# EAGLE board NeuroStimDuino (EAGLE 9.6.2)
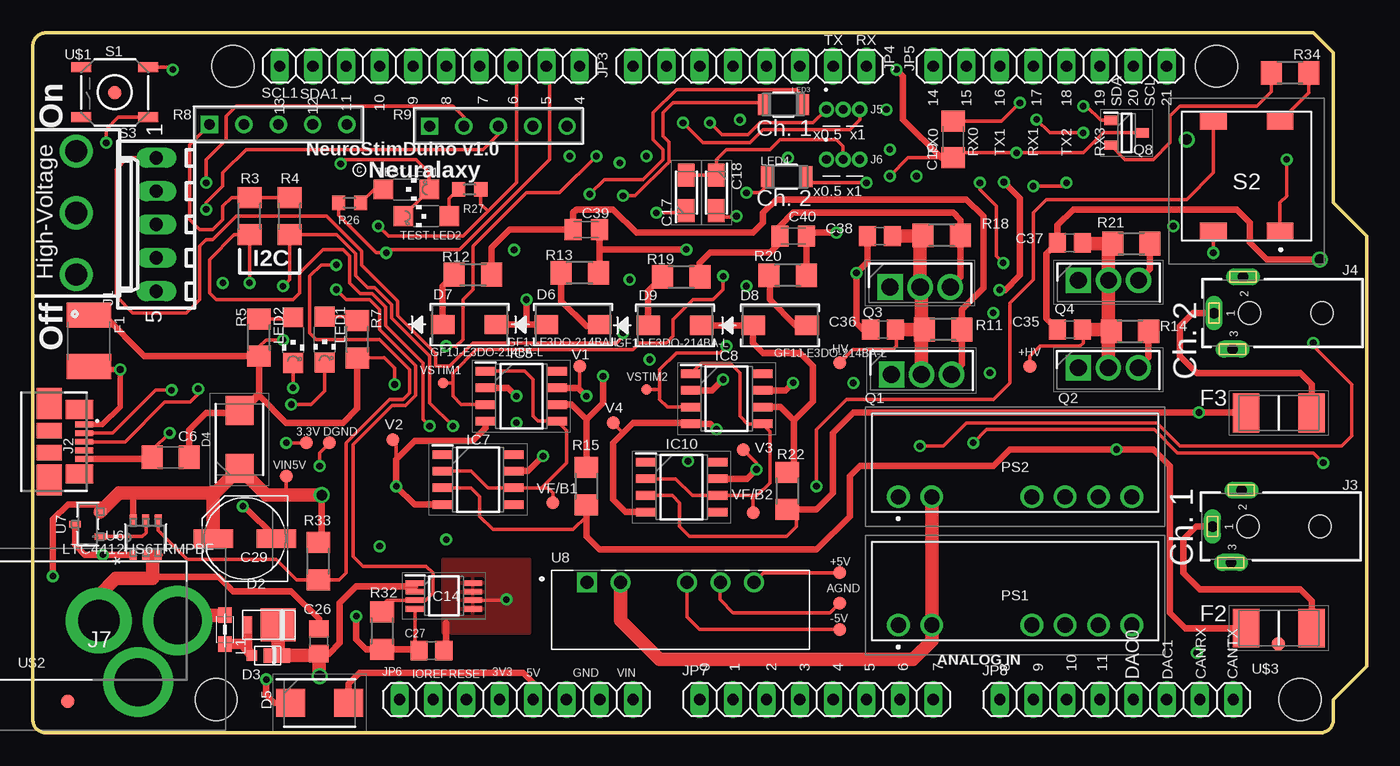
[diagram p6: board, top side]
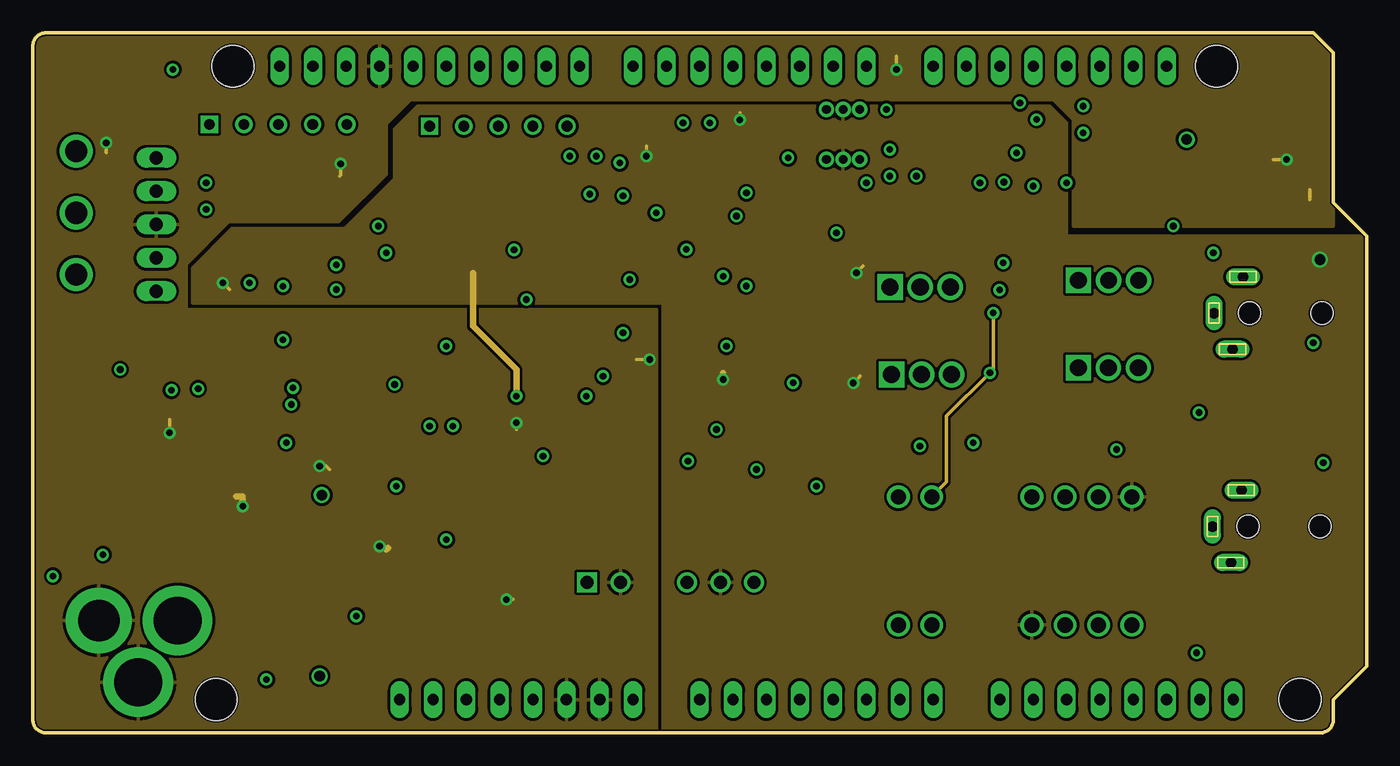
[diagram p7: board, inner layer Route2]
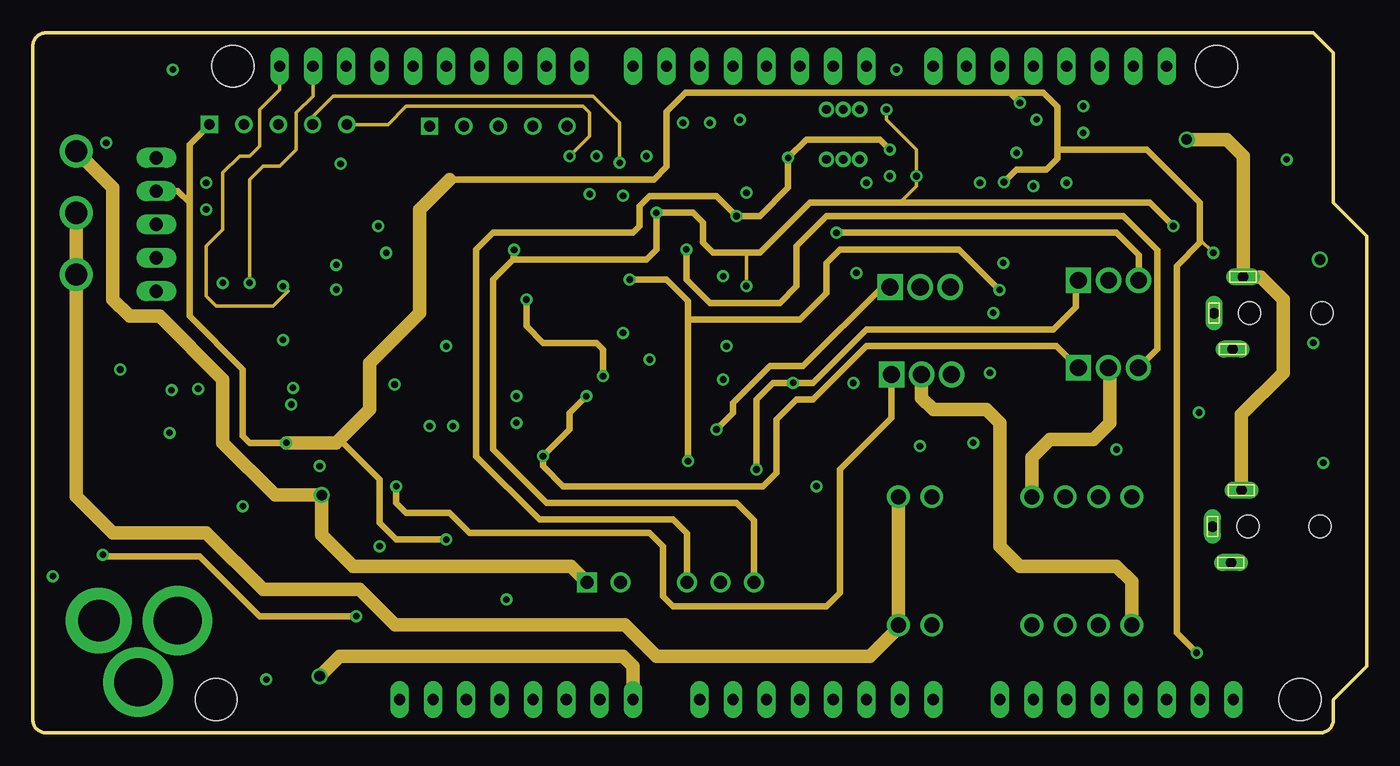
[diagram p8: board, inner layer Route15]
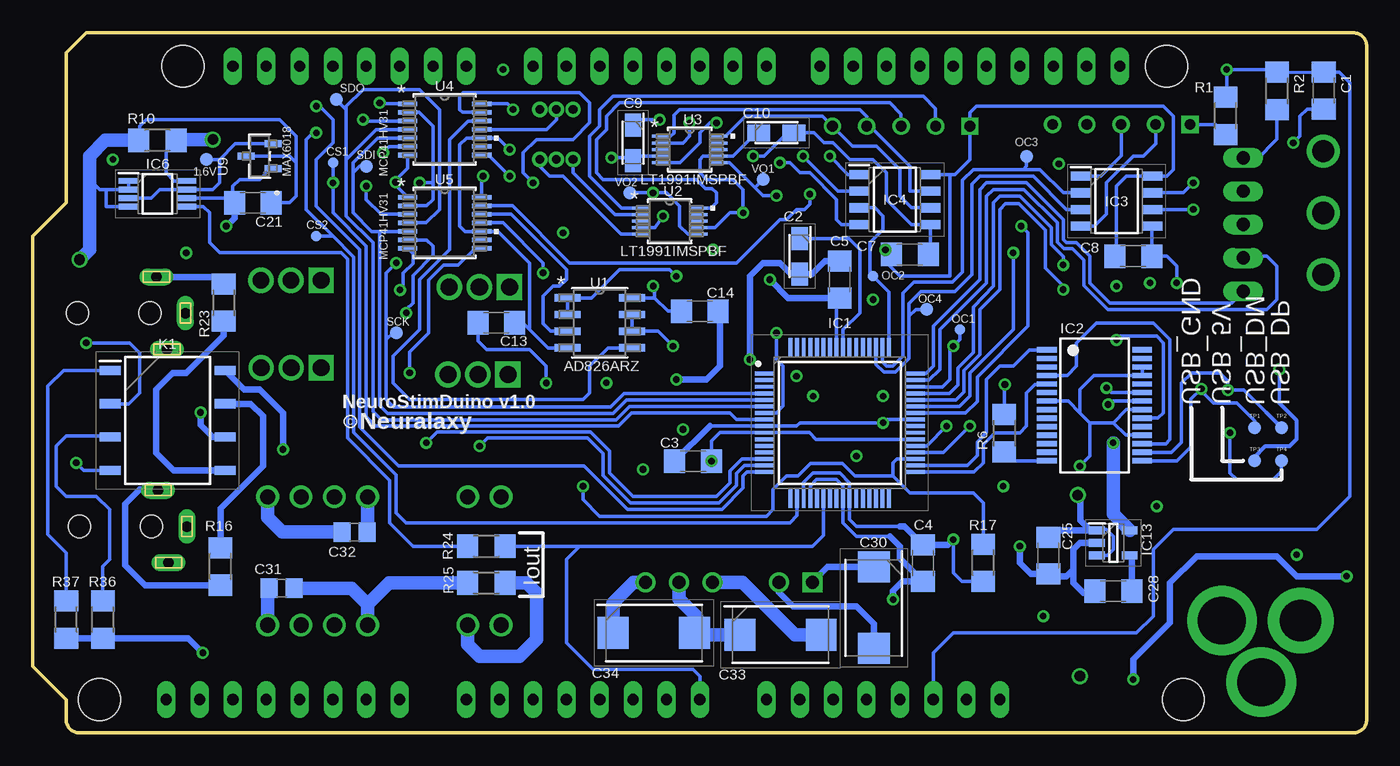
[diagram p9: board, bottom side, seen from below]

Size 101.6 x 53.34 mm. Coordinates in mm from the lower left corner, seen from the top.
Outline: 97.54,53.34 99.06,51.82 99.06,40.39 101.6,37.85 101.6,5.08 99.06,2.54 99.06,1 arc-90 98.06,0 1,0 arc-90 0,1 0,52.34 arc-90 1,53.34 97.54,53.34
Copper layers (1+2*15+16): Top 0.035mm / dielectric 0.2mm / Route2 0.035mm / dielectric 0.15mm / Route15 0.035mm / dielectric 0.2mm / Bottom 0.035mm
Design rules "default *": minimum track width 8mil, minimum drill 20mil, track to track 3mil, track to pad 3mil, pad to pad 3mil, via to via 3mil, smd to smd 3mil, copper to edge 5mil, drill to drill 5mil, minimum pad ring 10mil, minimum via ring 8mil, stop-mask expansion 4mil, vias tented up to drill 0mil, thermal gap 10mil
Net classes: 0 digital: width 0.203 mm, clearance 0.203 mm; 1 Power: width 0.254 mm, clearance 0.203 mm; 2 Signal: width 0.61 mm, clearance 0.305 mm; 3 usbvcc: width 0.203 mm, drill 0.406 mm, clearance 0.203 mm; 4 USBpair: width 0.254 mm, drill 0.406 mm, clearance 0.61 mm to class 0, clearance 0.61 mm to class 1, clearance 0.61 mm to class 2, clearance 0.61 mm to class 3
Holes 3.2 mm at 96.52,2.54 15.24,50.8 90.17,50.8 13.97,2.54
tRestrict: area 12.7,48.3 to 17.8,53.3; area 87.6,48.3 to 92.7,53.3; area 94,0 to 99.1,5.1; area 11.4,0 to 16.5,5.1
bRestrict: area 12.7,48.3 to 17.8,53.3; area 87.6,48.3 to 92.7,53.3; area 94,0 to 99.1,5.1; area 11.4,0 to 16.5,5.1

## Footprints (pad centres in the part's own frame; a part is rotated, then mirrored left to right if it is on the bottom)
TP10R = smd 1 x 1: TP 0,0
C1206 = smd 1.6 x 1.8: 1 -1.4,0; 2 1.4,0
CAPPM3216X180N = smd 1.75 x 1.25: 1 -1.35,0; 2 1.35,0
C0805 = smd 1.3 x 1.5: 1 -0.95,0; 2 0.95,0
PANASONIC_D = smd 3 x 1.4: + 2.4,0; - -2.4,0
CAPPM7343X310N = smd 2.35 x 2.45: 1 -3.1,0; 2 3.1,0
C0805K = smd 1.3 x 1.6: 1 -1,0; 2 1,0
TP08R = smd 0.8 x 0.8: TP 0,0
DO220AAL = smd 2.667 x 2.54: P$1 -0.7,0 | smd 0.762 x 1.27: P$2 1.65,0
MICROSMP = smd 0.8 x 0.8: A 1.2,0 | smd 2 x 1.1: K -0.7,0
DIOM5436X330N = smd 2.2 x 2.15: 1 -2.2,0; 2 2.2,0
DO-214BA-L = smd 1.803 x 1.473: 1 -2.045,0; 2 2.045,0
L1812 = smd 1.9 x 3.4: 1 -1.95,0; 2 1.95,0
FUSC6127X294N = smd 2.02 x 2.95: 1 -2.5,0; 2 2.5,0
QFP50P1200X1200X120-64N = smd 1.475 x 0.3: 1 -5.738,3.75; 2 -5.738,3.25; 3 -5.738,2.75; 4 -5.738,2.25; 5 -5.738,1.75; 6 -5.738,1.25; 7 -5.738,0.75; 8 -5.738,0.25; 9 -5.738,-0.25; 10 -5.738,-0.75; 11 -5.738,-1.25; 12 -5.738,-1.75; 13 -5.738,-2.25; 14 -5.738,-2.75; 15 -5.738,-3.25; 16 -5.738,-3.75; 33 5.738,-3.75; 34 5.738,-3.25; 35 5.738,-2.75; 36 5.738,-2.25; 37 5.738,-1.75; 38 5.738,-1.25; 39 5.738,-0.75; 40 5.738,-0.25; 41 5.738,0.25; 42 5.738,0.75; 43 5.738,1.25; 44 5.738,1.75; 45 5.738,2.25; 46 5.738,2.75; 47 5.738,3.25; 48 5.738,3.75 | smd 0.3 x 1.475: 17 -3.75,-5.738; 18 -3.25,-5.738; 19 -2.75,-5.738; 20 -2.25,-5.738; 21 -1.75,-5.738; 22 -1.25,-5.738; 23 -0.75,-5.738; 24 -0.25,-5.738; 25 0.25,-5.738; 26 0.75,-5.738; 27 1.25,-5.738; 28 1.75,-5.738; 29 2.25,-5.738; 30 2.75,-5.738; 31 3.25,-5.738; 32 3.75,-5.738; 49 3.75,5.738; 50 3.25,5.738; 51 2.75,5.738; 52 2.25,5.738; 53 1.75,5.738; 54 1.25,5.738; 55 0.75,5.738; 56 0.25,5.738; 57 -0.25,5.738; 58 -0.75,5.738; 59 -1.25,5.738; 60 -1.75,5.738; 61 -2.25,5.738; 62 -2.75,5.738; 63 -3.25,5.738; 64 -3.75,5.738
SSOP28 = smd 0.4 x 1.5: 1 -4.225,-3.625; 2 -3.575,-3.625; 3 -2.925,-3.625; 4 -2.275,-3.625; 5 -1.625,-3.625; 6 -0.975,-3.625; 7 -0.325,-3.625; 8 0.325,-3.625; 9 0.975,-3.625; 10 1.625,-3.625; 11 2.275,-3.625; 12 2.925,-3.625; 13 3.575,-3.625; 14 4.225,-3.625; 15 4.225,3.625; 16 3.575,3.625; 17 2.925,3.625; 18 2.275,3.625; 19 1.625,3.625; 20 0.975,3.625; 21 0.325,3.625; 22 -0.325,3.625; 23 -0.975,3.625; 24 -1.625,3.625; 25 -2.275,3.625; 26 -2.925,3.625; 27 -3.575,3.625; 28 -4.225,3.625
SOIC127P594X363-8N = smd 1.52 x 0.7: 1 -2.715,1.905; 2 -2.715,0.635; 3 -2.715,-0.635; 4 -2.715,-1.905; 5 2.715,-1.905; 6 2.715,-0.635; 7 2.715,0.635; 8 2.715,1.905
SOIC127P600X175-8N = smd 1.525 x 0.65: 1 -2.712,1.905; 2 -2.712,0.635; 3 -2.712,-0.635; 4 -2.712,-1.905; 5 2.712,-1.905; 6 2.712,-0.635; 7 2.712,0.635; 8 2.712,1.905
SOP65P490X110-8N = smd 1.475 x 0.45: 1 -2.212,0.975; 2 -2.212,0.325; 3 -2.212,-0.325; 4 -2.212,-0.975; 5 2.212,-0.975; 6 2.212,-0.325; 7 2.212,0.325; 8 2.212,0.975
SOT95P280X145-5N = smd 1.2 x 0.6: 1 -1.25,0.95; 2 -1.25,0; 3 -1.25,-0.95; 4 1.25,-0.95; 5 1.25,0.95
SOP65P490X109-8N = smd 1.415 x 0.45: 1 -2.192,0.975; 2 -2.192,0.325; 3 -2.192,-0.325; 4 -2.192,-0.975; 5 2.192,-0.975; 6 2.192,-0.325; 7 2.192,0.325; 8 2.192,0.975
6410-05 = drill 1.016 long: 1 5.08,0; 2 2.54,0; 3 0,0; 4 -2.54,0; 5 -5.08,0
47346-0001 = smd 0.45 x 1.38: 1 1.3,-4.81; 2 0.65,-4.81; 3 0,-4.81; 4 -0.65,-4.81; 5 -1.3,-4.81 | smd 1.475 x 2.1: 6 -2.453,-4.45; 7 2.453,-4.45 | smd 1.175 x 1.9: 8 0.838,-2.15; 9 -0.838,-2.15 | smd 2.375 x 1.9: 10 2.913,-2.15; 11 -2.913,-2.15
694101308002 = drill 0.8 pad 1.3 long: 1 0,-5.45; 2 -2.75,-3.25; 3 2.75,-4.05 | hole 1.7: 0,2.75; 0,-2.75
TMS-103-YY-XX-S = drill 0.66 pad 1.1: 1 0,0; 2 1.27,0; 3 2.54,0
CONSOCJ2155 = drill 3.64 pad 5.3: 1 0,0; 3 -3,-4.7 | drill 3.162 pad 5: 2 -6,0
1X10 = drill 0.85 pad 1.422 long: 1 -11.43,0; 2 -8.89,0; 3 -6.35,0; 4 -3.81,0; 5 -1.27,0; 6 1.27,0; 7 3.81,0; 8 6.35,0; 9 8.89,0; 10 11.43,0
1X08 = drill 0.85 pad 1.422 long: 1 -8.89,0; 2 -6.35,0; 3 -3.81,0; 4 -1.27,0; 5 1.27,0; 6 3.81,0; 7 6.35,0; 8 8.89,0
SOP254P940X229-8N = smd 1.6 x 0.7: 1 -4.375,3.81; 2 -4.375,1.27; 3 -4.375,-1.27; 4 -4.375,-3.81; 5 4.375,-3.81; 6 4.375,-1.27; 7 4.375,1.27; 8 4.375,3.81
0805 = smd 1.2 x 1: 1 -1.1,0; 2 1.1,0
CHIPLED_1206 = smd 1.5 x 1.5: A 0,-1.75; C 0,1.75
LED_KVG55W-4_SLD = smd 0.864 x 1.6: 1 -1.524,0; 2 1.524,0
NMT1272SC = drill 1.15 pad 1.725: 1 -8.89,1.17; 2 -6.35,1.17; 5 1.27,1.17; 6 3.81,1.17; 7 6.35,1.17; 8 8.89,1.17
TO229P300X760X1364-3P = drill 1.3 pad 1.95 square: 1 0,0 | drill 1.3 pad 1.95: 2 2.29,0; 3 4.58,0
TO229P290X760X1320-3P = drill 1.28 pad 1.92 square: 1 0,0 | drill 1.28 pad 1.92: 2 2.29,0; 3 4.58,0
SOT95P240X120-3N = smd 1 x 0.7: 1 -1.2,0.95; 2 -1.2,-0.95; 3 1.2,0
R1206 = smd 1.6 x 1.803: 1 -1.422,0; 2 1.422,0
BO_4605X = drill 0.813 pad 1.321 square: 1 0,0 | drill 0.813 pad 1.321: 2 2.616,0; 3 5.232,0; 4 7.849,0; 5 10.465,0
R0603 = smd 1 x 1.1: 1 -0.85,0; 2 0.85,0
TACTILE_SWITCH_SMD = smd 1.524 x 0.762: 1 -2.54,1.905; 2 2.54,1.905; 3 -2.54,-1.905; 4 2.54,-1.905
30062115 = smd 2.025 x 1.275: 1 2.538,-4.162; 2 -2.538,4.162; 3 -2.538,-4.162; 4 2.538,4.162
1000-SERIES(SPDT) = drill 1.68 pad 2.48: 1 0,-4.7; 2 0,0; 3 0,4.7
TP-1.00MM = smd 1 x 1 bottom: X 0,0
R_8_ADI = smd 1.981 x 0.559: 1 -2.464,1.905; 2 -2.464,0.635; 3 -2.464,-0.635; 4 -2.464,-1.905; 5 2.464,-1.905; 6 2.464,-0.635; 7 2.464,0.635; 8 2.464,1.905
MSOP-10_MS_LIT = smd 1.333 x 0.229: 1 -2.216,1.001; 2 -2.216,0.5; 3 -2.216,0; 4 -2.216,-0.5; 5 -2.216,-1.001; 6 2.216,-1.001; 7 2.216,-0.5; 8 2.216,0; 9 2.216,0.5; 10 2.216,1.001
TSSOP14_MC_MCH = smd 1.473 x 0.356: 1 -2.819,1.95; 2 -2.819,1.3; 3 -2.819,0.65; 4 -2.819,0; 5 -2.819,-0.65; 6 -2.819,-1.3; 7 -2.819,-1.95; 8 2.819,-1.95; 9 2.819,-1.3; 10 2.819,-0.65; 11 2.819,0; 12 2.819,0.65; 13 2.819,1.3; 14 2.819,1.95
TSOT-23_S6_ADI = smd 0.876 x 0.508: 1 -1.314,0.95; 2 -1.314,0; 3 -1.314,-0.95; 4 1.314,-0.95; 5 1.314,0; 6 1.314,0.95
TO-236_SOT23_NEX-L = smd 0.483 x 0.864: 1 -0.95,-0.965; 2 0.95,-0.965; 3 0,0.965
CONV_PDME1-S5-D5-S = drill 1 pad 1.5 square: 1 0,0 | drill 1 pad 1.5: 2 2.54,0; 4 7.62,0; 5 10.16,0; 6 12.7,0
21-0051H_MXM = smd 0.559 x 1.295: 1 -0.95,-1.029; 2 0.95,-1.029; 3 0,1.029
FIDUCIA-MOUNT = smd 1.016 x 1.016: P$1 0,0

## Placement (x,y rotation side)
1.6V  TPTP10R  [TP10R]  88.39,43.69 0 bottom
3.3V  TPTP10R  [TP10R]  20.83,22.1 0 top
+5V  TPTP10R  [TP10R]  61.47,12.19 0 top
+HV  TPTP10R  [TP10R]  75.95,27.94 0 top
-5V  TPTP10R  [TP10R]  61.47,7.87 0 top
-HV  TPTP10R  [TP10R]  61.47,28.19 0 top
AGND  TPTP10R  [TP10R]  61.47,9.91 0 top
C1  0.1uF  [C1206]  3.27,48.94 270 bottom
C2  F971C475MAAHT3  [CAPPM3216X180N]  43.18,36.32 270 bottom
C3  0.1uF  [C1206]  51.31,20.7 180 bottom
C4  0.1uF  [C1206]  33.8,12.94 270 bottom
C5  0.1uF  [C1206]  40.13,34.54 90 bottom
C6  10nF  [C1206]  10.49,20.99 180 top
C7  0.1uF  [C1206]  34.8,36.45 0 bottom
C8  0.1uF  [C1206]  17.78,36.32 0 bottom
C9  F971C475MAAHT3  [CAPPM3216X180N]  55.88,44.96 270 bottom
C10  F971C475MAAHT3  [CAPPM3216X180N]  44.96,45.72 0 bottom
C13  0.1uF  [C1206]  66.29,31.24 0 bottom
C14  0.1uF  [C1206]  50.8,32.13 0 bottom
C17  F971C475MAAHT3  [CAPPM3216X180N]  49.78,41.15 90 top
C18  F971C475MAAHT3  [CAPPM3216X180N]  52.07,41.15 270 top
C19  0.1uF  [C1206]  70.1,45.21 270 top
C21  100nF  [C1206]  84.84,40.39 0 bottom
C25  0.1uF  [C1206]  24.24,13.51 270 bottom
C26  1uF  [C0805]  21.8,6.99 90 top
C27  10uF  [C0805]  30.36,6.26 0 top
C28  10nF  [C1206]  19.3,10.81 180 bottom
C29  47uF  [PANASONIC_D]  16.15,14.81 180 top
C30  4.7uF  [CAPPM7343X310N]  37.53,9.54 270 bottom
C31  1uF  [C0805]  82.64,11.02 180 bottom
C32  1uF  [C0805]  77.1,15.3 180 bottom
C33  4.7uF  [CAPPM7343X310N]  44.64,7.48 0 bottom
C34  4.7uF  [CAPPM7343X310N]  54.3,7.61 0 bottom
C35  1uF  [C0805]  78.99,30.73 180 top
C36  1uF  [C0805]  64.77,30.73 180 top
C37  1uF  [C0805]  78.99,37.34 180 top
C38  1uF  [C0805]  64.52,37.85 180 top
C39  100nF  [C0805K]  42.16,38.35 180 top
C40  100nF  [C0805K]  57.91,37.85 180 top
CS1  TPTP08R  [TP08R]  78.74,43.43 0 bottom
CS2  TPTP08R  [TP08R]  80.01,37.85 0 bottom
D2  SS1P3L  [DO220AAL]  17.98,8.23 180 top
D3  MSS1P3L-M3/89A  [MICROSMP]  17.88,5.89 180 top
D4  LSM115JE3_TR13  [DIOM5436X330N]  15.75,22.35 90 top
D5  LSM115JE3_TR13  [DIOM5436X330N]  21.84,2.29 0 top
D6  GF1J-E3DO-214BA-L  [DO-214BA-L]  41.15,31.12 0 top
D7  GF1J-E3DO-214BA-L  [DO-214BA-L]  33.27,31.12 0 top
D8  GF1J-E3DO-214BA-L  [DO-214BA-L]  56.92,31.05 0 top
D9  GF1J-E3DO-214BA-L  [DO-214BA-L]  48.91,31.05 0 top
DGND  TPTP10R  [TP10R]  22.61,22.1 0 top
F1  MF-MSMF050-2 500mA  [L1812]  4.27,29.87 270 top
F2  0453.062MR  [FUSC6127X294N]  94.9,7.98 0 top
F3  0453.062MR  [FUSC6127X294N]  94.9,24.37 0 top
IC1  DSPIC33FJ256GP506A-I_PT  [QFP50P1200X1200X120-64N]  40.13,23.62 0 bottom
IC2  FT232RL  [SSOP28]  20.73,24.96 270 bottom
IC3  HCPL0531  [SOIC127P594X363-8N]  19.05,40.51 0 bottom
IC4  HCPL0531  [SOIC127P594X363-8N]  35.94,40.64 0 bottom
IC5  INA149AID  [SOIC127P600X175-8N]  37.21,25.65 0 top
IC6  TSC2011IDT  [SOP65P490X110-8N]  92.09,41.08 0 bottom
IC7  OPA140AID  [SOIC127P600X175-8N]  33.91,19.3 0 top
IC8  INA149AID  [SOIC127P600X175-8N]  52.85,25.46 0 top
IC10  OPA140AID  [SOIC127P600X175-8N]  49.42,18.73 0 top
IC13  TPS73633DBVR  [SOT95P280X145-5N]  19.3,14.48 0 bottom
IC14  MIC3975-5.0YMM-TR  [SOP65P490X109-8N]  31.31,10.44 0 top
J1  22-27-2051-05  [6410-05]  9.4,38.73 90 top
J2  47346-0001  [47346-0001]  -0.9,22.18 90 top
J3  [694101308002]  95.31,15.73 270 top
J4  [694101308002]  95.44,31.98 270 top
J5  TMS-103-02-L-S  [TMS-103-YY-XX-S]  60.45,47.5 0 top
J6  TMS-103-02-L-S  [TMS-103-YY-XX-S]  60.45,43.69 0 top
J7  CON-SOCJ-2155  [CONSOCJ2155]  11.02,8.56 0 top
JP3  FH254-110DF08500V  [1X10]  30.23,50.8 180 top
JP4  FH254-108DF08500V  [1X08]  54.61,50.8 180 top
JP5  FH254-108DF08500V  [1X08]  77.47,50.8 0 top
JP6  FH254-108DF08500V  [1X08]  36.83,2.54 0 top
JP7  FH254-108DF08500V  [1X08]  59.69,2.54 0 top
JP8  FH254-108DF08500V  [1X08]  82.55,2.54 0 top
K1  LBB110P  [SOP254P940X229-8N]  91.33,23.81 0 bottom
L1  MH2029-300Y  [0805]  14.63,7.87 90 top
LED1  [CHIPLED_1206]  22.22,29.97 180 top
LED2  [CHIPLED_1206]  19.83,29.93 180 top
LED3  XZMDKVG55W-4  [LED_KVG55W-4_SLD]  57.18,47.88 0 top
LED4  XZMDKVG55W-4  [LED_KVG55W-4_SLD]  57.43,42.37 0 top
LED5  [CHIPLED_1206]  28.45,41.4 270 top
LED6  [CHIPLED_1206]  29.97,39.37 90 top
OC1  TPTP08R  [TP08R]  30.99,30.73 90 bottom
OC2  TPTP08R  [TP08R]  37.59,34.8 0 bottom
OC3  TPTP10R  [TP10R]  25.91,43.94 0 bottom
OC4  TPTP10R  [TP10R]  33.53,32.26 0 bottom
PS1  NMT0572SC  [NMT1272SC]  74.82,7.04 0 top
PS2  NMT0572SC  [NMT1272SC]  74.82,16.82 0 top
Q1  MJE350  [TO229P300X760X1364-3P]  65.41,27.31 0 top
Q2  MJE340  [TO229P290X760X1320-3P]  79.63,27.81 0 top
Q3  MJE350  [TO229P300X760X1364-3P]  65.3,33.97 0 top
Q4  MJE340  [TO229P290X760X1320-3P]  79.65,34.48 0 top
Q8  MMBT3906  [SOT95P240X120-3N]  83.31,45.72 0 top
R1  10K  [R1206]  10.75,47.02 270 bottom
R2  470E  [R1206]  6.84,48.91 270 bottom
R3  10K  [R1206]  16.51,39.37 270 top
R4  10K  [R1206]  19.56,39.37 270 top
R5  330E  [R1206]  17.23,30.12 270 top
R6  10K  [R1206]  27.6,22.84 90 bottom
R7  330E  [R1206]  24.72,29.99 270 top
R8  4605X-101-221LF  [BO_4605X]  13.46,46.36 0 top
R9  4605X-101-332LF  [BO_4605X]  30.23,46.23 0 top
R10  0.5E  [R1206]  92.09,45.14 0 bottom
R11  44.2K, 1/2W  [R1206]  69.34,30.73 0 top
R12  10K, 1/2W  [R1206]  33.53,34.93 180 top
R13  10K, 1/2W  [R1206]  41.66,35.05 0 top
R14  44.2K, 1/2W  [R1206]  83.57,30.61 180 top
R15  100E, 1/2W  [R1206]  42.16,18.8 90 top
R16  10E, 3/4W  [R1206]  87.31,12.68 270 bottom
R17  3.3K  [R1206]  29.21,12.95 270 bottom
R18  44.2K, 1/2W  [R1206]  69.23,37.91 0 top
R19  10K, 1/2W  [R1206]  49.38,34.74 180 top
R20  10K, 1/2W  [R1206]  57.51,34.87 0 top
R21  44.2K, 1/2W  [R1206]  83.67,37.28 180 top
R22  100E, 1/2W  [R1206]  57.47,18.44 90 top
R23  10E, 3/4W  [R1206]  87.06,32.79 90 bottom
R24  0E  [R1206]  67.06,14.22 180 bottom
R25  0E  [R1206]  67.06,11.43 180 bottom
R26  330E  [R0603]  24.13,40.39 180 top
R27  1K  [R0603]  33.27,41.4 0 top
R32  100K  [R1206]  26.61,7.79 90 top
R33  470K  [R1206]  21.74,13.08 270 top
R34  220E  [R1206]  95.76,50.29 0 top
R36  330E  [R1206]  96.27,8.64 270 bottom
R37  330E  [R1206]  99.06,8.64 270 bottom
S1  SWITCH-MOMENTARY-2SMD  [TACTILE_SWITCH_SMD]  6.24,48.8 180 top
S2  3006.2115  [30062115]  92.46,42.42 0 top
S3  1101M2S3CQE2  [1000-SERIES(SPDT)]  3.3,39.62 0 top
SCK  TPTP10R  [TP10R]  73.91,30.48 0 bottom
SDI  TPTP10R  [TP10R]  76.2,43.18 0 bottom
SDO  TPTP10R  [TP10R]  78.49,48.26 0 bottom
TP1  DNP  [TP-1.00MM]  8.53,23.27 0 top
TP2  DNP  [TP-1.00MM]  6.5,23.27 0 top
TP3  DNP  [TP-1.00MM]  8.53,20.73 0 top
TP4  DNP  [TP-1.00MM]  6.5,20.73 0 top
U1  AD826ARZ  [R_8_ADI]  58.42,31.24 0 bottom
U2  LT1991IMSPBF  [MSOP-10_MS_LIT]  53.09,38.99 0 bottom
U3  LT1991IMSPBF  [MSOP-10_MS_LIT]  51.56,44.45 0 bottom
U4  MCP41HV31-103E/ST  [TSSOP14_MC_MCH]  70.23,45.97 0 bottom
U5  MCP41HV31-103E/ST  [TSSOP14_MC_MCH]  70.23,38.86 0 bottom
U6  LTC4412HS6TRMPBF  [TSOT-23_S6_ADI]  8.6,14.89 90 top
U7  PMV48XP,215TO-236_SOT23_NEX-L  [TO-236_SOT23_NEX-L]  4.18,15.9 90 top
U8  PDME1-S5-D5-S  [CONV_PDME1-S5-D5-S]  42.22,11.48 0 top
U9  MAX6018BEUR16+T  [21-0051H_MXM]  84.33,43.94 90 bottom
U$1  FIDUCIALMOUNT  [FIDUCIA-MOUNT]  6.22,48.77 0 top
U$2  FIDUCIALMOUNT  [FIDUCIA-MOUNT]  2.67,2.41 0 top
U$3  FIDUCIALMOUNT  [FIDUCIA-MOUNT]  94.87,6.78 0 top
V1  TPTP10R  [TP10R]  41.66,27.94 0 top
V2  TPTP10R  [TP10R]  27.43,22.35 0 top
V3  TPTP10R  [TP10R]  54.1,21.59 0 top
V4  TPTP10R  [TP10R]  44.2,23.62 0 top
VF/B1  TPTP10R  [TP10R]  39.62,17.53 180 top
VF/B2  TPTP10R  [TP10R]  54.86,16.76 0 top
VIN5V  TPTP10R  [TP10R]  19.3,19.56 0 top
VO1  TPTP10R  [TP10R]  45.97,42.16 0 bottom
VO2  TPTP10R  [TP10R]  56.13,41.15 0 bottom
VSTIM1  TPTP08R  [TP08R]  31.24,26.67 0 top
VSTIM2  TPTP08R  [TP08R]  46.74,26.16 180 top

## Tracks (layer width: path | path; a pad name or v marks a point on that pad's centre or on a via)
+3V3  (via drill 0.51)
  Top 0.254: R4.1 R3.1 15.14,40.79 14.48,40.13 14.48,39.12 13.72,38.35 12.7,38.35 11.94,39.12 11.94,44.83 R8.1 | C19.1 73.79,46.61 v75.18,48.01 | v89.92,36.58 S2.3 | 3.3V.TP v19.3,22.1
  Top 0.508: v73.96,41.96 75.18,40.74 75.18,34.87 74.07,33.76 v73.64,33.76 | S2.3
  Route15 0.254: 88.9,37.59 v89.92,36.58
  Route15 0.508: C3.1 49.91,31.5 | 49.91,31.5 49.91,32.9 48.26,34.54 v45.47,34.54 | v19.3,22.1 16.51,22.1 16,22.61 16,27.69 11.94,31.75 11.94,40.39 | J1.2 11.05,41.27 11.94,40.39 | 11.94,40.39 11.94,44.83 R8.1 | 23.11,22.1 23.62,22.1 26.42,19.3 26.42,16 27.69,14.73 v31.5,14.73 | 78.03,44.45 84.84,44.45 88.9,40.39 88.9,37.59 88.9,37.34 87.12,35.56 87.12,7.62 v88.65,6.1 | 31.75,42.16 47.32,42.16 48.28,43.13 48.28,47.32 49.73,48.77 74.42,48.77 | v73.64,33.76 73.61,33.76 70.54,36.83 61.47,36.83 60.45,35.81 60.45,33.53 58.42,31.5 49.91,31.5 | v75.18,48.01 74.42,48.77 | 74.42,48.77 76.96,48.77 78.03,47.7 78.03,44.45 | 78.03,44.45 78.03,43.74 77.22,42.93 74.93,42.93 v73.96,41.96
  Route15 1.016: v19.3,22.1 23.11,22.1 25.65,24.64 25.65,28.19 29.46,32 29.46,39.88 31.75,42.16
  Bottom 0.254: U5.1 73.96,41.72 v73.96,41.96 73.96,42.12 73.05,43.03 U4.7 | v75.18,48.01 75.1,47.92 U4.1 | R1.2 11.51,46.36 R8.1 | C3.1 49.91,22.23 49.26,22.87 IC1.10 42.43,22.87 41.93,22.37 IC1.38 | IC1.19 42.88,19.09 42.16,19.81 40.13,19.81 39.38,19.06 IC1.26 39.38,16.27 38.86,15.75 35.56,15.75 | IC1.57 40.38,32.89 C5.1 | R17.2 30.84,11.53 31.5,12.19 v31.5,14.73 | v73.64,33.76 73.38,34.01 73.38,35.03 72.64,35.76 72.64,36.51 U5.7
  Bottom 0.508: 35.56,15.75 35.21,15.75 C4.1 31.89,14.34 v31.5,14.73 | v45.47,34.54 44.07,33.14 C5.1 | R37.2 R36.2 89.76,7.21 v88.65,6.1
  Bottom 1.016: IC13.5 19.3,16.68 v19.3,22.1
  other vias: 49.91,20.7
+5V  (via drill 0.51)
  Top 0.254: C17.1 49.32,39.33 49.02,39.62 v47.5,39.62 | +5V.TP 55.64,12.19 U8.6
  Route15 0.254: 54.36,36.58 54.36,34.06 v54.34,34.05 | 66.04,40.39 67.31,41.66 v67.31,42.42 67.31,44.45 65.02,46.74 v65.02,47.5
  Route15 0.508: U8.6 54.92,16.2 53.59,17.53 39.12,17.53 35.05,21.59 35.05,34.54 36.58,36.07 | 36.58,36.07 46.74,36.07 47.5,36.83 v47.5,39.62 50.29,39.62 51.05,38.86 51.05,37.34 51.82,36.58 54.36,36.58 55.37,36.58 59.18,40.39 66.04,40.39 85.09,40.39 v86.87,38.61 | v36.66,36.8 36.63,36.78 36.63,36.12 36.58,36.07
  Bottom 0.254: IC4.8 31.75,42.55 | C8.1 19.05,36.45 19.05,41.66 18.29,42.42 IC3.8 15.24,42.42 14.73,42.93 14.73,46.99 15.49,47.75 29.72,47.75 30.23,47.24 R9.1 30.23,43.69 31.37,42.55 31.75,42.55 | 31.75,42.55 31.75,34.8 35.56,34.8 36.66,35.89 v36.66,36.8 | IC6.6 86.61,40.76 C21.1 86.36,40.51 86.36,41.66 85.85,42.16 84.33,42.16 83.5,42.99 U9.1 | U1.8 54.23,33.15 | C14.1 53.21,32.13 54.23,33.15 | C10.1 46.48,45.72 48.25,43.95 U3.7 50.54,43.95 50.8,43.69 50.8,42.67 50.29,42.16 48.26,42.16 47.5,41.4 v47.5,39.62 48.51,39.62 49.65,38.49 U2.7 | v54.34,34.05 54.23,33.93 54.23,33.15 | U4.14 65.45,47.92 v65.02,47.5 | U5.14 67.41,42.32 v67.31,42.42
  Bottom 0.508: v86.87,38.61 86.24,39.24 C21.1 | C7.1 36.55,36.8 v36.66,36.8
  Bottom 1.016: U8.6 55.83,11.48 57.4,9.91 C34.1
-5V  (via drill 0.51)
  Top 0.254: v53.59,39.37 53.42,39.29 52.58,39.29 C18.2 | -5V.TP 50.8,7.87 49.84,8.83 U8.4
  Route15 0.508: v65.28,44.45 64.52,45.21 58.93,45.21 v57.53,43.82 57.53,41.53 55.37,39.37 v53.59,39.37 52.07,40.89 46.99,40.89 46.23,40.13 46.23,38.61 45.72,38.1 35.05,38.1 33.78,36.83 33.78,21.06 38.59,16.26 48.77,16.26 49.84,15.18 U8.4
  Bottom 0.254: U1.4 62.36,29.34 63.75,30.73 | C13.2 64.26,31.24 63.75,30.73 | v53.59,39.37 54.22,38.49 U2.4 | v65.28,44.45 66.15,45.32 U4.10 68.57,45.32 69.09,44.81 69.09,38.61 68.69,38.21 U5.10 66.15,38.21 63.75,35.81 63.75,30.73 | v57.53,43.82 56.09,43.82 C9.2 55.54,43.95 U3.4
  Bottom 1.016: C33.2 43.55,7.48 47.54,11.48 U8.4
AGND  (via drill 0.51, 0.81)
  Top 0.254: 63.25,30.73 C36.2 | C17.2 C18.1 52.07,43.69 52.83,44.45 56.13,44.45 56.9,45.21 61.21,45.21 61.72,44.7 J6.2 | AGND.TP 60.71,9.14 53.34,9.14 52.32,10.16 52.32,11.42 U8.5
  Top 0.508: C38.2 63.57,35.88 v62.74,35.05 62.74,31.24 63.25,30.73 | C35.2 77.22,31.56 77.22,36.51 C37.2 78.04,38.67 79.25,39.88 91.69,39.88 92.71,38.86 92.71,37.34 93.98,36.07 v98.04,36.07 | IC8.2 51.75,26.09 v52.58,26.92 | IC5.2 36.2,26.29 v36.83,25.65
  Route2 0.254: v62.74,35.05 63.25,35.56 | v14.48,34.29 14.99,33.78 | v53.85,46.71 53.85,47.24 | v46.74,43.94 46.74,44.7 | v62.5,26.66 62.99,27.16 62.99,27.18
  Route2 0.508: v36.83,25.65 36.83,27.69 33.53,30.99 33.53,35.05 | v52.58,26.92 52.58,27.43
  Bottom 0.254: IC3.5 16.38,38.56 C8.2 15.24,36.32 14.48,35.56 v14.48,34.29 | C7.2 33.23,36.62 IC4.5 34.67,38.73 36.58,40.64 36.58,42.67 37.59,43.69 39.37,43.69 40.64,44.96 41.32,44.96 42.08,45.72 C10.2 44.12,45.72 45.89,43.94 v46.74,43.94 | R10.1 93.47,45.1 93.47,46.23 92.96,46.74 82.8,46.74 81.53,45.47 81.53,43.43 | IC6.1 IC6.2 96.01,41.41 | 96.01,41.41 96.01,40.11 IC6.4 | U9.3 82.04,43.94 81.53,43.43 | 81.53,43.43 81.53,40.89 82.04,40.39 C21.2 | U5.11 65.79,38.86 62.74,35.81 v62.74,35.05 | C9.1 55.48,46.71 v53.85,46.71 | C13.1 67.69,29.85 67.06,29.21 63.75,29.21 62.5,27.95 v62.5,26.66 | 96.01,41.41 96.52,41.41 97.03,41.91 97.28,41.91 | J5.2 61.72,46.74 62.48,45.97 U4.11
  Bottom 0.508: C14.2 49.27,32.26 49.27,27.94 50.29,26.92 v52.58,26.92
  Bottom 1.016: C31.1 77.32,11.02 76.09,9.8 | 76.09,9.8 PS1.5 | C32.2 82.61,15.3 83.71,16.4 PS2.8 | R10.1 96.08,45.14 97.28,43.94 97.28,41.91 97.28,36.83 v98.04,36.07 | R25.2 74.46,11.43 76.09,9.8 | C33.1 51.06,7.48 | 51.06,7.48 C34.2 | U8.5 52.38,10.22 51.05,8.89 51.05,7.49 51.06,7.48
  pour Route2: 48.01,0 48.01,32.77 12.19,32.77 12.19,35.43 15.16,38.4 23.75,38.4 27.56,42.21 27.56,46 29.31,47.75 77.47,47.75 78.74,46.48 78.74,37.85 101.6,37.85 101.6,5.08 99.06,2.54 99.06,0
BD+  (via drill 0.51)
  Top 0.254: v12.6,26.21 12.6,25.81 11.99,25.2 10.06,25.2 7.05,22.18 J2.3
  Bottom 0.254: IC2.15 14.45,20.73 13.39,21.79 13.39,25.43 v12.6,26.21 12.6,26.06 11.68,25.15 9.91,25.15 8.53,23.77 TP1.X
BD-  (via drill 0.51)
  Top 0.254: v10.57,26.11 9.35,26.11 6.07,22.83 J2.2
  Bottom 0.254: IC2.16 14.87,21.38 14.12,22.12 14.12,26.65 13.33,27.43 11.18,27.43 10.57,26.82 v10.57,26.11 9.35,26.11 7.62,24.38
  Bottom 0.305: TP2.X 7.62,24.38
CH1_EN!  (via drill 0.51)
  Top 0.254: v67.56,21.84 69.34,21.84 71.12,23.62 85.6,23.62 87.38,21.84 99.7,21.84 100.46,22.61 100.46,26.54 97.54,29.46 v97.54,29.72
  Bottom 0.254: K1.2 94.3,25.08 93.47,25.91 93.47,28.96 94.23,29.72 v97.54,29.72 | IC1.15 47.39,20.37 48,19.77 48,18.86 49.32,17.53 56.09,17.53 58.16,19.61 58.16,21.27 59.35,22.47 66.94,22.47 v67.56,21.84
CH2_EN!  (via drill 0.51)
  Top 0.254: v71.63,22.1 72.64,23.11 85.41,23.11 87.19,21.34 97.54,21.34 v98.3,20.57
  Bottom 0.254: K1.4 97.72,20 v98.3,20.57 | IC1.14 47.6,20.87 48.51,19.96 48.51,19.05 49.53,18.03 55.88,18.03 57.66,19.81 57.66,21.48 59.1,22.92 70.8,22.92 v71.63,22.1
COMM_RET  (via drill 0.81)
  Route15 1.016: J3.2 92.06,24.24 95.25,27.43 95.25,33.02 93.54,34.73 J4.2 92.19,43.96 90.93,45.21 v87.88,45.21
  Bottom 0.254: IC6.8 90.82,42.05 91.44,42.67 91.44,44.38 90.61,45.21
  Bottom 0.508: J4.2 87.59,34.73 R23.2 | R16.2 93.05,11.26 94.55,12.76 94.55,17.46 93.47,18.54 92.12,18.54 J3.2
  Bottom 1.016: v87.88,45.21 90.61,45.21 R10.2
CS_DIGIPOT1  (via drill 0.51)
  Top 0.254: v78.74,41.91 78.49,41.66 v76.2,41.66
  Bottom 0.254: IC1.8 48,23.87 48.51,24.38 55.99,24.38 57,23.38 75.48,23.38 76.2,24.1 76.2,37.08 78.74,39.62 v78.74,41.91 CS1.TP | U5.3 75.07,39.51 76.2,40.64 v76.2,41.66
CS_DIGIPOT2  (via drill 0.51)
  Top 0.254: v80.01,45.72 77.47,45.72 v76.45,46.74
  Bottom 0.254: IC1.18 43.38,16.56 43.94,16 73.15,16 73.91,16.76 73.91,19.65 77.17,22.9 77.17,36.27 78.74,37.85 | v80.01,45.72 80.26,45.72 80.77,45.21 80.77,39.88 78.74,37.85 | v76.45,46.74 76.34,46.62 U4.3 | CS2.TP 78.74,37.85
DC_5V  (via drill 0.51)
  Top 0.254: IC14.4 29.12,6.55 C27.1
  Top 0.508: U7.3 3.21,14.31 3.95,13.57 v5.33,13.57 U6.1 | v24.64,8.89 24.64,7.11 25.38,6.37 R32.1 29.31,6.37 | 29.31,6.37 C27.1 | 29.12,6.55 29.31,6.37
  Route15 0.508: v5.33,13.57 5.45,13.46 12.7,13.46 17.27,8.89 v24.64,8.89
EOFF_R!  (via drill 0.51)
  Top 0.254: v80.01,47.75 80.26,47.75 81.35,46.67 Q8.1
  Bottom 0.254: IC1.16 47.18,19.87 47.5,19.56 47.5,18.65 49.12,17.03 56.29,17.03 59.6,20.34 73.73,20.34 76.71,23.32 76.71,36.83 80.01,40.13 80.01,43.69 78.74,44.96 78.74,46.74 79.76,47.75 v80.01,47.75
ERR_FLG  (via drill 0.51)
  Top 0.254: R32.2 26.61,9.72 27.01,10.11 IC14.3 29.93,10.11 30.48,10.67 30.48,12.19 29.97,12.7 25.15,12.7 24.38,13.46 24.38,21.96 27.37,24.94 28.38,24.94 29.16,25.72 29.16,27.99 26.42,30.73 26.42,32.26 25.65,33.02 23.88,33.02 v23.11,33.78
  Bottom 0.254: IC1.44 31.27,25.37 30.68,25.96 30.68,27.62 29.46,28.84 29.46,32.26 27.94,33.78 27.94,39.88 27.5,40.32 26.49,40.32 24.49,38.32 24.49,35.41 23.11,34.04 v23.11,33.78
GND  (via drill 0.51)
  Top 0.254: S2.1 95,40.39 95.5,40.89 v95.5,43.69 | S1.1 6.51,46.9 5.59,45.97 v5.59,44.96 | IC14.6 36.02,10.11 v36.07,10.16 | 8.98,20.88 8.83,20.73 | C6.2 9.09,21.54 v10.41,22.86 | v65.28,42.42 66.67,43.81 C19.2 70.49,44.2 v74.93,44.2 80.01,44.2 81.53,45.72 Q8.3 | LED6.C 30.2,41.35 LED5.C 30.2,42.7 29.21,43.69 23.78,43.69 v23.45,43.36 | v21.84,20.32 21.84,21.34 DGND.TP
  Top 0.508: J2.5 8.98,20.88 C6.2 | C27.2 31.5,6.45 31.5,8.38 | U6.2 9.14,13.57 U6.3 9.65,13.57 | S2.1 | C19.2 69.22,43.81 66.29,46.74 66.29,50.04 v65.79,50.55 | 9.14,11.89 14.17,11.89 15.26,10.79 19.69,10.79 21.8,8.68 C26.2 | C29.- 16.09,17.27 v16,17.27 | 5,8.58 J7.2
  Top 1.016: 9.14,13.57 9.14,11.89 9.14,11.76 6.32,11.76 5,10.44 5,8.58 | U8.2 44.76,8.58 47.75,5.59 67.06,5.59 68.47,7 PS1.2 PS2.2
  Route2 0.254: v5.59,44.96 5.59,44.2 | 97.28,41.4 97.28,40.64 | v36.07,10.16 36.58,10.16 | v10.41,22.86 10.41,23.88 | v46.99,28.45 45.97,28.45 | v21.84,20.32 22.35,20.32 22.61,20.07 | v95.5,43.69 94.49,43.69 | v36.83,23.62 36.83,23.11 | PS2.2 69.6,19.12 69.6,24.13 v72.9,27.43 73.15,27.69 v73.15,32 | v65.79,50.55 65.79,51.56 | v23.45,43.36 23.45,42.5 23.37,42.42
  Route2 0.508: v16,17.27 16,18.03 15.49,18.03 | v26.42,14.22 26.67,14.22 26.92,13.97 27.05,14.1
  Bottom 0.254: IC1.20 42.38,18.83 41.91,19.3 40.39,19.3 39.88,18.8 IC1.25 39.88,16.01 38.86,14.99 36.32,14.99 | 50.03,23.37 IC1.9 43.43,23.37 43.18,23.62 v36.83,23.62 36.58,23.87 IC1.41 | IC2.21 18.3,24.63 19.3,23.62 | IC2.7 22.74,25.28 21.84,24.38 | 19.3,23.62 21.08,23.62 | 21.84,24.38 21.08,23.62 | v5.59,44.96 5.08,45.47 5.08,46.99 4.53,47.54 C1.2 | IC2.18 18.36,22.68 19.3,23.62 | IC2.26 IC2.25 20.78,27.23 21.84,26.16 21.84,24.38 | v10.41,22.86 10.41,19.81 9.91,19.3 7.11,19.3 6.5,19.92 TP4.X | 21.08,23.62 21.08,21.08 v21.84,20.32 | v72.9,27.43 72.9,29.02 71.44,30.48 71.44,34.51 70.3,35.64 69.19,35.64 67.92,36.91 U5.8 | U4.8 66.88,44.02 v65.28,42.42 | U5.6 71.6,37.56 71.12,37.08 71.12,36.39 72.64,34.86 72.64,32.77 73.15,32.26 v73.15,32 | U4.6 74.45,44.67 v74.93,44.2
  Bottom 0.508: C30.2 37.53,8.32 38.86,9.65 43.69,9.65 44.76,10.72 U8.2 | IC13.2 21.84,14.48 22.35,13.97 22.35,12.45 | 22.35,12.45 22.86,11.94 24.07,11.94 C25.2 25.57,12.11 26.42,12.95 v26.42,14.22 | 22.35,12.45 22.35,11.43 21.59,10.67 20.85,10.67 C28.2 | C3.2 50.03,23.37 | 36.32,14.99 35.56,14.22 35.56,13.3 C4.2 35.38,11.54 36.09,10.82 36.09,10.19 v36.07,10.16 | v46.99,28.45 46.99,34.8 45.97,35.81 44.7,35.81 43.86,34.97 C2.2 42.24,34.97 41.27,35.94 C5.2
  Bottom 1.016: R25.1 64.01,11.43 63.25,10.67 63.25,7.11 64.52,5.84 67.56,5.84 68.47,6.75 PS1.2
  pour Top: 31.24,7.62 37.85,7.62 37.85,13.21 31.24,13.21
  pour Route2: 0,53.34 0,0 47.5,0 47.5,32.26 11.68,32.26 11.68,35.69 14.94,38.94 23.29,38.94 26.9,42.55 26.9,46.38 28.78,48.26 77.72,48.26 79.25,46.74 79.25,38.61 99.06,38.61 99.06,51.82 97.54,53.34
INT0  (via drill 0.51)
  Top 0.254: v59.69,18.8 59.69,23.11 61.98,25.4 73.15,25.4 74.42,26.67 74.42,32.77 76.2,34.54 76.2,39.62 77.22,40.64 87.88,40.64 89.92,42.67 S2.2
  Bottom 0.254: IC1.35 35.77,20.87 36.07,20.57 36.07,19.56 | R17.1 29.21,17.53 29.97,18.29 34.8,18.29 36.07,19.56 | 36.07,19.56 38.98,19.56 39.94,20.52 42.35,20.52 43.32,19.56 44.2,19.56 45.21,18.54 45.21,17.02 45.72,16.51 58.42,16.51 59.69,17.78 v59.69,18.8
IOUT
  Bottom 0.254: IC1.22 41.38,15.06 42.22,14.22 R24.1 59.94,14.22 60.96,13.21 60.96,6.86 58.93,4.83 51.31,4.83 50.8,4.32 JP7.1
MASTER-RESET  (via drill 0.51)
  Top 0.254: S1.3 10.51,50.71 v10.67,50.55
  Bottom 0.254: R1.1 10.67,48.52 v10.67,50.55 7.07,50.55 R2.1 3.29,50.31 C1.1 2.08,50.34 1.27,49.53 1.27,18.03 3.81,15.49 14.73,15.49 16.26,13.97 16.26,8.89 17.53,7.62 31.5,7.62 33.02,6.1 JP6.3
N$1
  Bottom 0.254: IC1.56 39.88,30.73 38.61,32 38.61,36.83 39.45,37.67 C2.1
N$2  (via drill 0.51)
  Top 0.254: J5.3 62.99,46.74 62.23,45.97 55.63,45.97 54.61,44.96 51.05,44.96 v49.53,46.48
  Bottom 0.254: v49.53,46.48 50.04,46.48 50.8,45.72 50.8,44.96 52.31,43.45 U3.5
N$3
  Bottom 0.254: IC4.7 34.8,41.27 34.8,43.18 37.85,46.23 R9.4 38.07,46.97 38.61,47.5 52.32,47.5 52.76,47.06 52.76,45.7 53.02,45.45 U3.1
N$4
  Bottom 0.254: IC4.6 34.67,40.01 35.56,40.89 35.56,42.93 37.34,44.7 39.17,44.7 R9.5 41.44,46.98 47.31,46.98 48.84,45.45 U3.10
N$5  (via drill 0.51)
  Top 0.254: v13.21,41.91 13.21,43.69 14.73,45.21 14.73,46.99 15.49,47.75 32,47.75 32.84,46.91 R9.2
  Bottom 0.254: IC3.7 13.97,41.15 v13.21,41.91 | U2.1 56.75,39.99 59.18,42.42 59.18,45.47 58.42,46.23 58.42,47.5 57.4,48.51 33.78,48.51 32.84,47.57 R9.2
N$6
  Bottom 0.508: C28.1 17.9,13.38 IC13.4
N$7  (via drill 0.51)
  Top 0.254: v13.21,39.88 13.21,40.39 14.48,41.66 14.48,42.67 16.26,44.45 34.31,44.45 35.46,45.6 R9.3
  Bottom 0.254: IC3.6 v13.21,39.88 | U2.10 49.93,39.99 49.53,40.39 49.53,41.15 49.85,41.47 50.36,41.47 51.05,42.16 58.17,42.16 58.67,42.67 58.67,45.21 57.91,45.97 57.91,46.99 56.9,48.01 36.32,48.01 35.46,47.14 R9.3
N$8  (via drill 0.51)
  Route15 0.254: v44.7,43.43 44.7,46.48 42.67,48.51 22.88,48.51 21.31,46.95 R8.4
  Bottom 0.254: IC4.4 40,38.73 40.39,39.12 40.39,40.64 42.42,42.67 43.18,42.67 43.94,43.43 v44.7,43.43
N$9  (via drill 0.51)
  Route15 0.254: v40.89,43.94 42.42,45.47 42.42,47.24 41.91,47.75 28.45,47.75 27.05,46.36 R8.5
  Bottom 0.254: v40.89,43.94 39.5,42.55 IC4.1
N$10
  Route15 1.016: PS2.1 PS1.1 66.04,8.13 63.75,5.84 47.5,5.84 45.13,8.21 27.6,8.21 24.89,10.92 17.53,10.92 13.21,15.24 6.1,15.24 3.3,18.03 S3.1 S3.2
N$11
  Top 0.508: D5.2 24.04,3.72 24.89,4.57 37.34,4.57 38.1,3.81 JP6.5
N$12
  Top 0.254: S2.4 97.18,48.77 R34.2
N$13
  Bottom 0.254: IC3.1 20.24,42.42 18.69,43.97 R8.3
N$14
  Bottom 0.254: K1.1 99.26,27.62 100.46,26.42 100.46,15.11 99.06,13.72 R37.1
N$15
  Bottom 0.254: IC3.4 20.75,38.61 19.81,39.55 19.81,41.91 17.78,43.94 17.02,43.94 16.08,44.88 R8.2
N$16  (via drill 0.51)
  Top 0.254: v44.96,40.92 45.88,40.92 48.46,43.5 48.46,45.01 48.01,45.47 48.01,47.24 48.77,48.01 55.52,48.01 LED3.1
  Bottom 0.254: U3.6 48.53,43.45 46.61,41.53 | v44.96,40.92 46,40.92 46.61,41.53 | VO1.TP 46.61,41.53
N$17
  Bottom 0.254: R36.1 96.27,12.7 95.76,13.21 95.76,17.02 96.77,18.03 99.06,18.03 99.82,18.8 99.82,21.84 99.06,22.61 95.78,22.61 K1.3
N$18
  Top 0.254: Q8.2 83.19,43.69 85.34,43.69 86.61,44.96 86.61,46.99 87.38,47.75 93.22,47.75 94.34,48.87 R34.1
N$19
  Bottom 0.254: IC6.5 88.62,40.11 88.14,39.62 88.14,37.34 87.38,36.58 78.12,36.58 77.62,36.08 77.62,22.45 74.42,19.25 74.42,16 72.64,14.22 R24.2
N$20
  Top 0.254: U7.1 8.35,14.95 8.64,15.24 8.64,16.17 U6.5
N$21  (via drill 0.51)
  Top 0.254: v51.56,46.48 52.48,45.57 54.46,45.57 55.37,46.48 59.44,46.48 J5.1
  Bottom 0.254: U3.2 52.08,44.95 51.56,45.47 v51.56,46.48
N$22
  Bottom 0.254: U2.5 56.78,37.99 61.21,42.42 62.23,42.42 62.99,43.18 J6.3
N$23
  Bottom 0.254: U2.2 57.27,39.49 60.45,42.67 J6.1
N$24
  Bottom 0.254: U5.12 65.17,39.51 60.96,35.31 60.96,34.54 61.47,34.04 61.98,34.04 62.74,33.27 62.74,31.19 62.15,30.61 U1.3
N$25
  Bottom 0.254: IC6.3 92.59,40.76 91.95,41.41 IC6.7 87.88,41.4 87.38,41.91 87.38,43.69 | U9.2 86.17,44.89 87.38,43.69 | 1.6V.TP 87.38,43.69
N$26
  Bottom 0.254: U1.5 57.78,29.34 59.18,27.94 59.18,25.91 59.69,25.4 72.9,25.4 74.17,26.67 74.17,28.7 72.14,30.73 72.14,34.54 69.85,36.83 69.85,45.21 68.44,46.62 U4.12
N$27  (via drill 0.51)
  Top 0.254: v54.36,41.15 55.37,41.15 55.91,41.68 LED4.1
  Bottom 0.254: U2.6 51.7,37.99 52.32,38.61 52.32,40.13 53.34,41.15 v54.36,41.15 VO2.TP
N$30
  Top 0.254: R27.1 31.72,40.7 LED6.A
N$31
  Top 0.254: R26.1 26,41.4 LED5.A
N$32  (via drill 0.51)
  Top 0.254: v42.41,41.05 43.53,42.16 46.48,42.16 48.01,43.69 48.01,44.45 47.24,45.21 47.24,47.24 49.02,49.02 58.17,49.02 58.7,48.49 LED3.2
  Bottom 0.254: U5.13 65.05,40.16 60.71,35.81 48.01,35.81 44.7,39.12 44.2,39.12 43.43,39.88 42.82,39.88 42.41,40.28 v42.41,41.05
N$38  (via drill 0.51)
  Top 0.254: v63.5,41.91 59.41,41.91 LED4.2
  Bottom 0.254: U4.13 68.86,47.27 69.09,47.5 69.09,48.51 68.83,48.77 59.94,48.77 59.18,48.01 59.18,46.48 60.45,45.21 63.25,45.21 64.26,44.2 64.26,42.67 v63.5,41.91
N$45  (via drill 0.51)
  Top 0.254: V2.TP 27.69,22.1 27.69,20.83
  Top 0.508: IC7.4 29.08,17.4 v27.69,18.8 27.69,20.83 29.08,22.23 33.48,22.23 34.5,23.24 IC5.4
  Route15 0.508: Q1.1 65.41,24 61.47,20.07 61.47,10.67 60.45,9.65 48.77,9.65 48.01,10.41 48.01,14.22 46.99,15.24 33.27,15.24 31.75,16.76 28.45,16.76 27.69,17.53 v27.69,18.8
N$46
  Top 0.254: IC5.1 37.46,27.56 38.1,26.92 38.1,24.13 38.48,23.75 IC5.5 40.64,23.03 40.64,20.57 38.73,18.67 | IC7.2 33.4,19.94 34.67,18.67 IC7.6 38.73,18.67 | VF/B1.TP 39.62,18.29 39.24,18.67 38.73,18.67
N$47  (via drill 0.51)
  Top 0.508: Q2.3 84.99,28.59 R14.1 | v49.78,36.83 43.18,36.83 | 43.18,36.83 43.16,36.83 C39.1 | 43.18,36.83 43.18,35.15 R13.2
  Route15 0.508: Q2.3 85.65,29.25 85.65,36.78 83.06,39.37 60.45,39.37 58.17,37.08 58.17,34.04 56.9,32.77 51.56,32.77 49.78,34.54 v49.78,36.83
N$48
  Top 0.508: Q1.3 70.76,28.08 R11.2 70.76,32.26 72.39,33.88 72.39,39.37 71.12,40.64 56.64,40.64 55.63,39.62 55.63,38.86 54.86,38.1 45.97,38.1 44.2,39.88 41.4,39.88 41.15,39.62 41.15,38.35 C39.2 36.32,38.35 34.95,36.98 R12.1
N$49
  Top 0.508: R13.1 40.23,32.92 42.16,30.99 43.07,30.99 D6.2
N$50
  Top 0.508: D7.1 31.23,34.05 R12.2
N$51  (via drill 0.51)
  Top 0.508: D7.2 37.59,31.12 | 37.59,31.12 D6.1 | IC5.6 41.02,25.02 42.16,23.88 | 42.16,23.88 R15.2 | 42.16,23.88 43.43,25.15 v43.43,27.18 | v37.59,33.02 37.59,31.12
  Route15 0.508: v43.43,27.18 43.43,29.21 42.93,29.72 38.86,29.72 37.59,30.99 v37.59,33.02
N$52  (via drill 0.51)
  Top 0.254: V1.TP 41.66,26.42 41.53,26.29
  Top 0.508: IC5.7 41.53,26.29 v42.16,25.65 | IC7.7 37.72,19.94 v38.86,21.08
  Route15 0.508: v42.16,25.65 40.89,24.38 40.89,23.11 v38.86,21.08 38.86,20.32 40.39,18.8 55.63,18.8 56.64,19.81 56.64,23.88 58.17,25.4 59.44,25.4 63.5,29.46 77.98,29.46 Q2.1
N$53
  Bottom 0.508: R16.1 87.31,17.09 84.07,20.32 84.07,24.13 85.02,25.08 K1.7
N$54  (via drill 0.51)
  Top 0.254: IC7.3 33.4,18.67 34.04,18.03 34.04,16.51 35.05,15.49 41.15,15.49 42.16,16.51 R15.1
  Top 0.508: R15.1 42.16,14.99 43.18,13.97 59.69,13.97 62.23,16.51 62.23,19.56 62.99,20.32 73.15,20.32 74.42,21.59 v82.55,21.59 85.34,21.59 86.61,20.32 86.61,9.14 87.77,7.98 F2.1
  Bottom 0.508: v82.55,21.59 82.55,24.38 84.33,26.16 85.5,26.16 K1.8
N$55
  Bottom 0.508: K1.5 90.86,20 92.2,21.34 92.2,26.16 90.93,27.43 89.92,27.43 87.06,30.29 R23.1
N$56
  Top 0.508: J3.1 88.63,15.73 87.63,14.73 87.63,12.19 88.9,10.92 96.52,10.92 97.4,10.04 F2.2
N$57  (via drill 0.51)
  Top 0.508: R20.2 58.91,34.89 C40.1 59.17,38.1 v61.21,38.1 | Q4.3 85.09,35.34 R21.1
  Route15 0.508: Q4.3 84.23,36.42 82.55,38.1 v61.21,38.1
N$58
  Top 0.508: R19.1 50.8,35.81 51.56,36.58 56.15,36.58 56.91,37.34 C40.2 56.91,38.62 57.91,39.62 70.1,39.62 70.66,39.07 R18.2 70.66,34.75 Q3.3
N$59
  Top 0.508: R20.1 56.13,34.82 56.13,33.02 58.11,31.05 D8.2
N$60
  Top 0.508: R19.2 46.87,33.65 D9.1
N$61
  Top 0.508: IC8.6 56.96,24.82 57.98,23.81 | 57.98,23.81 57.98,20.37 R22.2 | 57.98,23.81 59.44,25.26 59.44,27.94 58.42,28.96 55.63,28.96 54.86,29.72 54.87,29.73 D8.1 D9.2
N$62
  Top 0.254: IC8.1 50.9,28.13 53.15,28.13 53.85,27.43 53.85,24.13 54.42,23.55 IC8.5 56.13,22.98 56.13,19.05 55.18,18.09 54.86,18.09 | IC10.2 48.96,19.36 50.23,18.09 IC10.6 54.86,18.09 | VF/B2.TP 54.86,18.09
N$63  (via drill 0.51)
  Top 0.254: V3.TP 55.12,20.57 v55.12,20.07
  Top 0.508: IC10.7 54.41,19.36 v55.12,20.07 | v57.91,26.67 57.34,26.09 IC8.7
  Route15 0.508: v55.12,20.07 55.12,25.4 56.39,26.67 v57.91,26.67 59.44,26.67 63.5,30.73 77.72,30.73 79.43,32.44 79.43,34.26 Q4.1
N$64  (via drill 0.51)
  Top 0.254: V4.TP 44.96,22.86
  Top 0.508: IC10.4 45.15,16.82 44.2,17.78 44.2,22.1 44.96,22.86 45.72,23.62 50.07,23.62 IC8.4 51.63,23.55 v52.07,23.11
  Route15 0.508: Q3.1 64.7,33.97 58.67,27.94 56.13,27.94 53.34,25.15 53.34,24.38 v52.07,23.11
N$65  (via drill 0.51)
  Top 0.254: IC10.3 48.71,18.09 49.28,17.53 49.28,15.75 50.04,14.99 57.4,14.99 58.17,15.75 58.17,16.83 57.98,17.01 R22.1
  Top 0.508: R22.1 59.68,17.01 60.96,18.29 60.96,22.86 62.51,24.41 v88.82,24.41 92.36,24.41 F3.1
  Bottom 0.508: K1.6 87.92,22.54 88.82,23.44 v88.82,24.41
N$66
  Top 0.508: J4.1 88.37,31.98 87.38,30.99 87.38,28.7 88.65,27.43 96.52,27.43 97.4,26.55 F3.2
N$107
  Top 0.813: L1.1 16,6.77 16.33,6.35 | 16.33,6.35 D3.A | D2.P$2 16.33,6.35
N$146
  Bottom 0.254: IC2.17 15.31,22.03 14.99,22.35 14.99,29.97 16.26,31.24 20.57,31.24 22.1,29.72 22.1,27.94 22.81,27.23 IC2.4
N$147  (via drill 0.51)
  Top 0.254: v19.81,26.29 19.83,26.3 LED2.C
  Bottom 0.254: IC2.23 19.45,25.93 v19.81,26.29
N$148
  Top 0.254: LED2.A 19.67,31.52 R5.1
N$149
  Top 0.254: LED1.A 24.39,31.72 R7.1
N$150  (via drill 0.51)
  Top 0.254: v19.69,25.02 21.21,25.02 22.23,26.04 LED1.C
  Bottom 0.254: IC2.22 19.42,25.28 v19.69,25.02
N$151
  Bottom 0.254: IC2.14 26.91,20.73 27.48,21.3 R6.1
OC1  (via drill 0.51)
  Top 0.254: v42.93,43.94 40.13,41.15 37.59,41.15 33.53,37.08 33.53,33.78 32.77,33.02 32.77,29.97 32.26,29.46 v31.5,29.46
  Bottom 0.254: IC1.46 32.3,26.37 31.75,26.92 31.75,29.21 v31.5,29.46 30.99,29.97 OC1.TP | v42.93,43.94 40.26,41.27 IC4.2
OC2
  Bottom 0.254: IC1.49 36.38,33.59 OC2.TP 37.85,35.05 37.85,37.34 36.83,38.35 36.83,39.37 37.46,40.01 IC4.3
OC3
  Bottom 0.254: IC1.50 36.88,28.25 36.58,27.94 36.07,27.94 35.31,28.7 35.31,33.53 34.49,34.34 31.56,34.34 30.79,35.12 30.79,42.11 29.97,42.93 26.16,42.93 | 26.16,42.93 24.89,42.93 23.11,41.15 IC3.2 | OC3.TP 25.91,43.18 26.16,42.93
OC4
  Bottom 0.254: 34.85,31.75 34.85,28.51 35.88,27.48 36.77,27.48 37.36,28.08 37.36,29.34 IC1.51 | 34.85,31.75 34.85,32.72 33.93,33.63 31.37,33.63 30.07,34.93 30.07,41.81 29.46,42.42 25.4,42.42 22.86,39.88 IC3.3 | OC4.TP 34.34,32.26 34.85,31.75
PGC_2
  Bottom 0.254: IC1.48 33.59,27.37 33.02,27.94 33.02,30.99 29.46,34.54 29.46,41.4 28.96,41.91 25.91,41.91 23.11,39.12 23.11,37.59 22.86,37.34 22.1,37.34 21.08,36.32 21.08,34.29 19.56,32.77 10.29,32.77 J1.5
PGD_2
  Bottom 0.254: IC1.47 33.33,26.87 32.51,27.69 32.51,30.73 28.96,34.29 28.96,40.89 28.45,41.4 26.11,41.4 23.57,38.86 23.57,37.4 23.05,36.88 22.4,36.88 21.54,36.02 21.54,34.1 19.7,32.26 7.62,32.26 6.86,33.02 6.86,35.56 7.62,36.32 9.27,36.32 J1.4
PWM9  (via drill 0.51)
  Top 0.254: JP3.2 39.37,50.55 39.37,43.69 32.51,36.83 27.18,36.83 v26.92,36.58 26.16,36.58 23.28,39.46 R26.2
  Bottom 0.254: IC1.43 31.01,24.87 30.23,25.65 30.23,27.43 26.92,30.73 v26.92,36.58
PWM10  (via drill 0.51)
  Top 0.254: v26.31,38.61 27.08,37.84 32.76,37.84 34.67,39.75 | JP3.3 36.83,50.55 36.83,41.91 34.67,39.75 | R27.2 34.12,40.3 34.67,39.75
  Bottom 0.254: IC1.42 30.55,24.37 29.67,25.25 29.67,27.13 25.81,30.99 25.81,38.1 v26.31,38.61
RESET!  (via drill 0.51)
  Top 0.254: J1.1 7.24,43.82 6.35,42.93 6.35,33.27 7.62,32 11.68,32 12.7,33.02 12.7,37.08 13.21,37.59 13.72,37.59 15.49,39.37 22.38,39.37 25.04,36.7 25.04,35.66 27.79,32.92 27.79,31.79 30.68,28.89 30.68,27.99 30.73,27.94 31.75,27.94 33.53,29.72 44.45,29.72 44.96,30.23 v44.96,30.48
  Bottom 0.254: R2.2 6.84,45.23 8.38,43.69 9.27,43.69 J1.1 | IC1.7 44.97,24.37 44.45,24.89 44.45,27.94 44.96,28.45 v44.96,30.48
RX_1
  Bottom 0.254: IC1.34 30.43,20.37 29.67,21.13 29.67,22.17 28.96,22.88 28.96,26.92 27.94,27.94 26.92,27.94 25.68,29.18 IC2.1
SCK2  (via drill 0.51)
  Top 0.254: v72.14,41.91 72.14,41.4 73.41,40.13 73.41,36.32 v73.91,35.81
  Bottom 0.254: 71.12,41.91 71.12,46.23 72.17,47.27 U4.2 | IC1.4 56.57,25.87 57.6,24.84 74.11,24.84 74.68,25.4 74.68,29.97 | 74.68,29.97 74.68,35.05 v73.91,35.81 | v72.14,41.91 71.12,41.91 | 71.12,41.91 71.12,40.64 71.6,40.16 U5.2 | SCK.TP 74.17,30.48 74.68,29.97
SCL1  (via drill 0.51)
  Top 0.254: v32,23.37 30.23,25.15 30.23,28.7 27.33,31.6 27.33,32.64 26.03,33.93 25.5,33.93 24.59,34.85 24.59,36.51 23.15,37.95 R4.2 19.56,34.54 v19.05,34.04
  Route15 0.254: v19.05,34.04 19.43,33.66 18.29,32.51 13.97,32.51 13.21,33.27 13.21,37.08 14.48,38.35 14.48,42.67 15.75,43.94 16.51,43.94 17.27,44.7 17.27,47.5 18.8,49.02 JP3.10
  Bottom 0.254: IC1.37 33.5,21.87 v32,23.37
SDA1  (via drill 0.51)
  Top 0.254: v30.23,23.37 29.72,23.88 29.72,28.19 26.87,31.04 26.87,32.45 25.84,33.48 24.94,33.48 24.13,34.29 24.13,36.32 23.62,36.83 22.1,36.83 20.32,35.05 20.32,33.53 19.81,33.02 13.97,33.02 13.46,33.53 13.46,36.07 15.34,37.95 R3.2 v16.51,34.29
  Route15 0.254: v16.51,34.29 16.51,42.16 17.53,43.18 18.8,43.18 20.07,44.45 20.07,47.24 21.34,48.51 JP3.9
  Bottom 0.254: IC1.36 32.22,21.37 v30.23,23.37
SDI2
  Bottom 0.254: U4.5 75.33,45.32 77.22,43.43 77.22,42.67 | 77.22,42.67 77.22,39.62 75.8,38.21 75.18,38.21 | IC1.5 56.36,25.37 57.4,24.34 74.57,24.34 75.18,24.95 75.18,38.21 | U5.5 75.18,38.21 | SDI.TP 76.71,43.18 77.22,42.67
SDO2
  Bottom 0.254: U5.4 71.63,38.86 70.61,39.88 70.61,47.5 72.14,49.02 76.45,49.02 77.72,47.75 77.72,47.5 | U4.4 75.44,45.97 77.72,43.69 | 77.72,47.5 77.72,43.69 | IC1.6 56.15,24.87 57.19,23.84 75.04,23.84 75.69,24.49 75.69,37.34 77.72,39.37 77.72,43.69 | SDO.TP 77.72,47.5
SUPPLY_STATUS  (via drill 0.51)
  Top 0.254: U6.4 9.55,15.44 11.76,13.23 18.52,13.23 20.09,11.66 R33.2 23.34,11.66 23.88,12.19 23.88,22.1 27.18,25.4 28.19,25.4 28.7,25.91 28.7,27.69 26.42,29.97 21.59,29.97 21.08,30.48 21.08,34.8 21.95,35.66 v23.11,35.66
  Bottom 0.254: IC1.45 31.79,25.87 31.14,26.52 31.14,27.81 29.97,28.98 29.97,32.46 28.45,34.04 28.45,40.39 27.94,40.89 26.42,40.89 24.03,38.51 24.03,37.21 23.11,36.3 v23.11,35.66
TX_1
  Bottom 0.254: IC2.5 24.39,26.54 25.27,26.54 25.91,25.91 25.91,23.37 26.42,22.86 28.33,22.86 29.21,21.98 29.21,20.57 29.91,19.87 IC1.33
USB_5V  (via drill 0.51)
  Top 0.254: v27.56,26.54 27.56,27.81 26.77,28.6 R7.2 | v19.05,29.95 17.76,29.95 17.23,29.42 R5.2 17.23,26.03 D4.2
  Top 0.508: R7.2 24.72,24.72 23.62,23.62 19.3,23.62 17.23,25.7 | 17.23,25.7 R5.2 8.49,28.72 5.39,31.82 F1.1 | 17.23,25.7 15.91,24.38 13.21,24.38 11.89,23.07 C6.1
  Bottom 0.254: R6.2 27.6,26.5 v27.56,26.54 | v19.05,29.95 18.77,30.23 16,30.23 15.49,29.72 15.49,24.38 15.9,23.98 IC2.20
VCC
  Top 0.254: +HV.TP 75.95,28.7 76.71,29.46 79.76,29.46 80.01,29.72 80.01,30.67 C35.1
  Top 0.508: 81.92,30.38 R14.2 82.02,30.73
  Top 1.016: Q2.2 81.92,30.38 | 82.02,30.73 C35.1 | R14.2 81.94,30.81 Q4.2 81.94,36.97 R21.2 80,37.28 C37.1
  Route15 0.508: 82.04,27.69 Q2.2
  Route15 1.016: PS2.5 76.09,20.98 77.47,22.35 80.77,22.35 82.04,23.62 82.04,27.69
  Bottom 1.016: PS2.5 76.09,15.36 C32.1
VIN  (via drill 0.81)
  Top 0.254: IC14.2 29.12,11.18 IC14.1
  Top 0.508: C26.1 22.55,6.04 23.37,6.86 23.37,9.91 24.64,11.18 29.12,11.18
  Top 1.016: v21.84,4.32 21.8,4.37 C26.1 21.65,5.89 D3.K 18.68,5.99 D2.P$1
  Route15 1.016: v21.84,4.32 23.37,5.84 44.96,5.84 45.72,5.08 JP6.8
VIN+
  Top 1.016: J7.1 11.44,8.97 L1.2
VIN_5V  (via drill 0.51, 0.81)
  Top 0.254: VIN5V.TP 19.3,18.12
  Top 0.508: U6.6 7.65,18.26 7.62,18.29 | D5.1 18.39,2.29 17.78,2.9 v17.78,4.06 | 5.7,17.41 2.68,17.41 1.52,16.26 v1.52,11.94 | R33.1 22.01,14.77 v22.01,18.12
  Top 1.016: U7.2 5.7,17.41 6.58,18.29 7.62,18.29 13.88,18.29 | 13.88,18.29 D4.1 17.78,18.12 19.3,18.12 v22.01,18.12 | C29.+ 13.75,18.16 13.88,18.29
  Route15 1.016: U8.1 41,12.7 24.38,12.7 22.01,15.07 v22.01,18.12 18.46,18.12 14.48,22.1 14.48,26.92 9.65,31.75 7.37,31.75 6.1,33.02 6.1,41.53 S3.3
  Bottom 0.254: IC13.3 19.75,13.53 19.3,13.97 19.3,14.99 19.81,15.49 20.49,15.49 IC13.1
  Bottom 0.508: U8.1 41.06,12.64 C30.1 | C25.1 23.73,15.43 IC13.1 21.06,15.43 21.82,16.19 21.82,17.93 v22.01,18.12 | v1.52,11.94 5.33,11.94 6.86,13.46 12.95,13.46 14.99,11.43 14.99,8.38 17.78,5.59 v17.78,4.06
VSS
  Top 0.254: -HV.TP 62.48,29.21 65.53,29.21 65.79,29.46 65.79,30.67 C36.1
  Top 0.508: 67.7,30.51 R11.1
  Top 1.016: Q1.2 67.7,30.51 67.7,33.86 Q3.2 67.59,37.68 R18.1 67.75,37.85 C38.1 | R11.1 C36.1
  Route15 1.016: PS1.8 83.71,11.54 82.55,12.7 75.18,12.7 73.66,14.22 73.66,23.62 72.64,24.64 68.58,24.64 67.7,25.52 Q1.2
  Bottom 1.016: PS1.8 83.71,10.9 C31.2
VSTIM1  (via drill 0.51)
  Top 0.254: IC5.3 32.64,25.02 32,25.65 32,26.67 | 32,26.67 32,27.43 33.78,29.21 45.72,29.21 46.23,29.72 48.26,29.72 48.77,30.23 48.77,31.5 50.29,33.02 51.82,33.02 52.58,33.78 v52.58,34.8 | VSTIM1.TP 32,26.67
  Bottom 0.254: U1.2 U1.1 59.05,33.15 56.9,35.31 53.09,35.31 v52.58,34.8
VSTIM2  (via drill 0.51)
  Top 0.254: IC8.3 48.33,24.82 47.75,25.4 47.75,26.16 | 47.75,26.16 47.75,27.69 49.02,28.96 52.32,28.96 v52.83,29.46 | VSTIM2.TP 47.75,26.16
  Bottom 0.254: U1.7 U1.6 53.97,30.61 v52.83,29.46
XVCC  (via drill 0.51)
  Top 0.406: F1.2 5.38,27.92 5.38,27.69 v6.65,27.69 6.65,24.84 5.3,23.48 J2.1
  Bottom 0.254: 6.65,25.12 v6.65,27.69
  Bottom 0.305: TP3.X 8.53,21.04 7.72,21.84 5.87,21.84 5.33,22.38 5.33,23.8 6.65,25.12

## Text on the board
tPlace: On | 9 | 8 | 7 | 6 | 5 | 4 | 14 | 15 | 16 | 17 | 18 | 19 | 20 | 21 | 13 | 12 | 11 | 10 | Ch. 1 | x0.5 | x1 | NeuroStimDuino v1.0 | c | Neuralaxy | TEST LED1 | x0.5 | x1 | Ch. 2 | TEST LED2 | I2C | High-Voltage | Off | 0 | 1 | 2 | 3 | 4 | 5 | 6 | 7 | 8 | 9 | 10 | 11 | DAC0 | DAC1 | CANRX | CANTX
bPlace: MCP41HV31 | MCP41HV31 | USB_DP | USB_DM | USB_5V | USB_GND | NeuroStimDuino v1.0 | Neuralaxy | c | Iout
tNames: TX | RX | SCL1 | SDA1 | SDA | SCL | TX0 | RX0 | TX1 | RX1 | TX2 | RX3 | Ch. 2 | Ch. 1 | IOREF | RESET | ANALOG IN | 3V3 | 5V | GND | VIN
bNames: MAX6018
tValues: 270E | 270E | MIC3975-5
bValues: 10K
tDocu: DISCLAIMER / / Reference Designs ARE PROVIDED "AS IS" AND "WITH ALL FAULTS. Neuralaxy LLC DISCLAIMS ALL OTHER WARRANTIES, EXPRESS OR IMPLIED, / REGARDING PRODUCTS, INCLUDING BUT NOT LIMITED TO, ANY IMPLIED WARRANTIES OR MERCHANTABILITY OR FITNESS FOR A PARTICULAR PURPOSE / / Neuralaxy LLC may make changes to specifications and product descriptions at any time, without notice. The Customer must not rely on the absence or / characteristics of any features or instructions marked "reserved" or "undefined". Neuralaxy LLC reserves these for future definition and shall have no responsibility / whatsoever for conflicts or incompabilities arising from future changes to them. The product information on the Web Site or Materials is subject to change without / notice. Do not finalize a design with this info
FRNTMAAT1: SCL | SDA | AREF | GND3 | 13 | 12 | 11 | 10 | 9 | 8 | 7 | 6 | 5 | 4 | 3 | 2 | 1 | 0 | 14 | 15 | 16 | 17 | 18 | 19 | 20 | 21 | DC_vin- | DC_vin+ | GND4 | IOREF | RESET | 3V3 | 5V_1 | GND1 | GND2 | VIN | A0 | A1 | A2 | A3 | A4 | A5 | A6 | A7 | A8 | A9 | A10 | A11 | A12 | A13 | A14 | A15